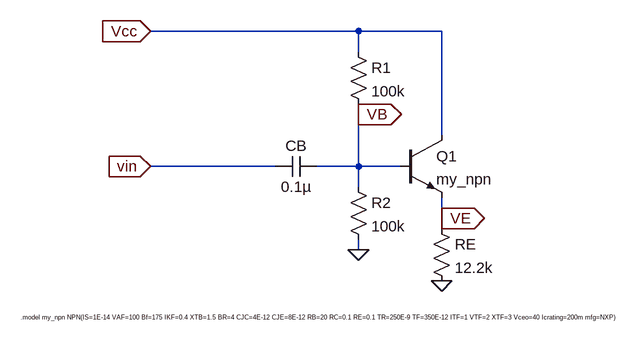
[diagram p0: schematic EF_NPN_Q1.asc]
EF_NPN_Q1.asc, the LTspice schematic file:
Version 4
SHEET 1 2800 760
WIRE 352 144 32 144
WIRE 480 144 352 144
WIRE 352 176 352 144
WIRE 352 272 352 256
WIRE 480 304 480 144
WIRE 224 352 32 352
WIRE 352 352 352 272
WIRE 352 352 288 352
WIRE 416 352 352 352
WIRE 352 384 352 352
WIRE 480 432 480 400
WIRE 480 448 480 432
WIRE 352 480 352 464
FLAG 480 528 0
FLAG 352 480 0
FLAG 480 432 VE
IOPIN 480 432 Out
FLAG 352 272 VB
IOPIN 352 272 Out
FLAG 32 144 Vcc
IOPIN 32 144 In
FLAG 32 352 vin
IOPIN 32 352 In
SYMBOL npn 416 304 R0
SYMATTR InstName Q1
SYMATTR Value my_npn
SYMBOL Res 464 432 R0
SYMATTR InstName RE
SYMATTR Value 12.2k
SYMBOL Res 336 160 R0
SYMATTR InstName R1
SYMATTR Value 100k
SYMBOL Res 336 368 R0
SYMATTR InstName R2
SYMATTR Value 100k
SYMBOL Cap 288 336 R90
WINDOW 0 0 32 VBottom 2
WINDOW 3 32 32 VTop 2
SYMATTR InstName CB
SYMATTR Value 0.1µ
TEXT -168 584 Left 0 !.model my_npn NPN(IS=1E-14 VAF=100 Bf=175 IKF=0.4 XTB=1.5 BR=4 CJC=4E-12 CJE=8E-12 RB=20 RC=0.1 RE=0.1 TR=250E-9 TF=350E-12 ITF=1 VTF=2 XTF=3 Vceo=40 Icrating=200m mfg=NXP)

The netlist it stands for:
* EF_NPN_Q1.asc
Q1 Vcc VB VE 0 my_npn
RE VE 0 12.2k
R1 Vcc VB 100k
R2 VB 0 100k
CB VB vin 0.1µ
.model NPN NPN
.model PNP PNP
.lib standard.bjt
.model my_npn NPN(IS=1E-14 VAF=100 Bf=175 IKF=0.4 XTB=1.5 BR=4 CJC=4E-12 CJE=8E-12 RB=20 RC=0.1 RE=0.1 TR=250E-9 TF=350E-12 ITF=1 VTF=2 XTF=3 Vceo=40 Icrating=200m mfg=NXP)
.backanno
.end